# EAGLE design 526_outin_picoRev102 (EAGLE 9.6.0)
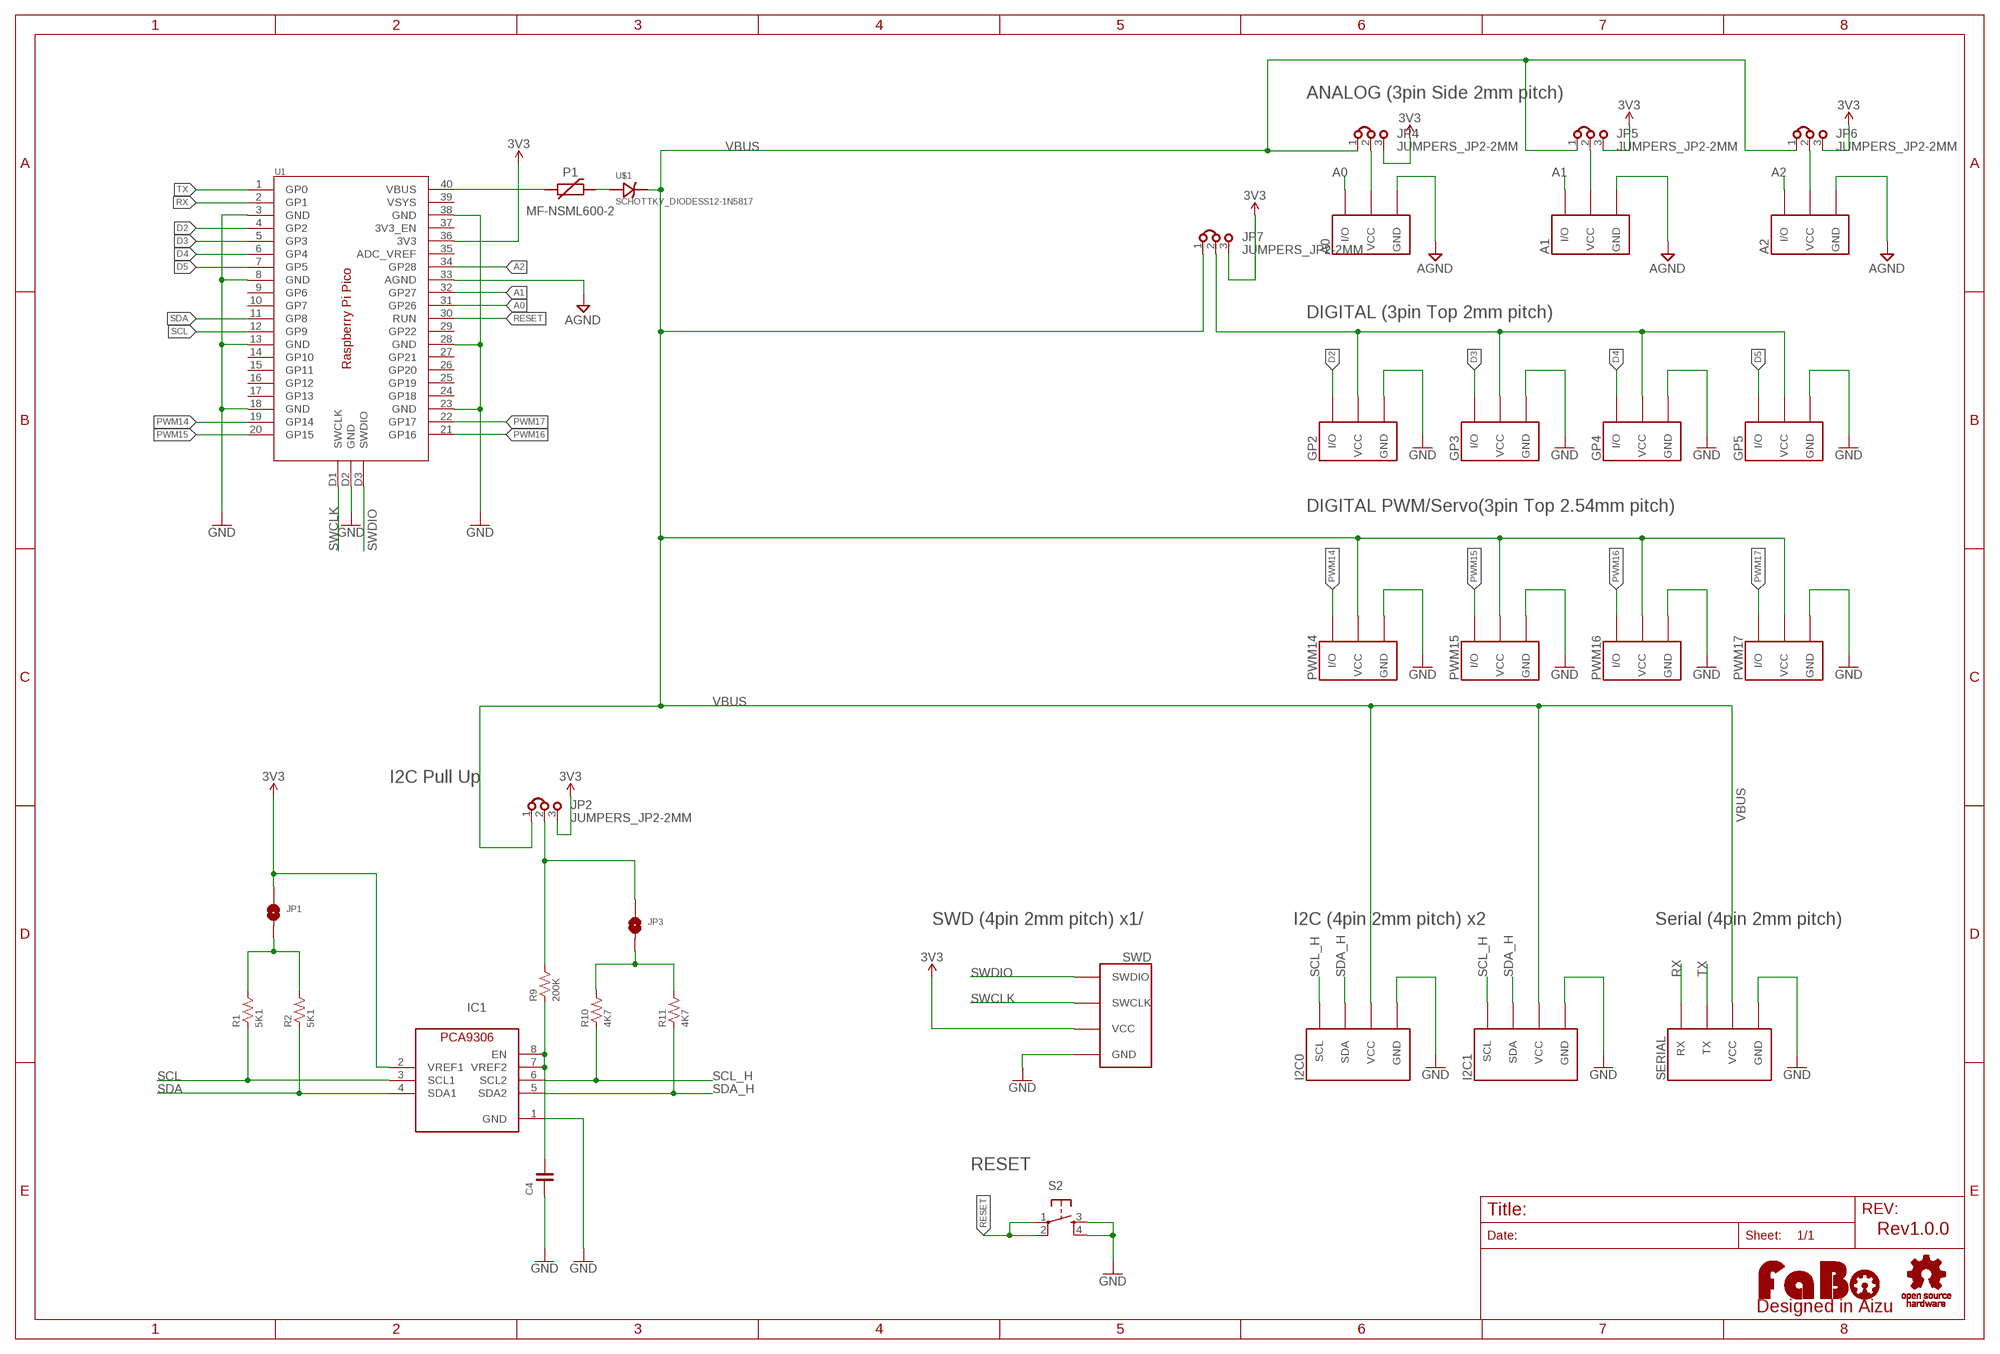
[diagram p0: schematic, sheet 1]

## Parts
A0  FABO_BRICK_3PIN-S03B-PASK-2_LONG  [FABO_BRICK_3PIN_S03B-PASK-2_LONG]
A1  FABO_BRICK_3PIN-S03B-PASK-2_LONG  [FABO_BRICK_3PIN_S03B-PASK-2_LONG]
A2  FABO_BRICK_3PIN-S03B-PASK-2_LONG  [FABO_BRICK_3PIN_S03B-PASK-2_LONG]
C4  CAPACITOR-0603_NARROW  [0603-NARROW]
GP2  FABO_BRICK_3PIN-S03B-PASK-2_LONG  [FABO_BRICK_3PIN_S03B-PASK-2_LONG]
GP3  FABO_BRICK_3PIN-S03B-PASK-2_LONG  [FABO_BRICK_3PIN_S03B-PASK-2_LONG]
GP4  FABO_BRICK_3PIN-S03B-PASK-2_LONG  [FABO_BRICK_3PIN_S03B-PASK-2_LONG]
GP5  FABO_BRICK_3PIN-S03B-PASK-2_LONG  [FABO_BRICK_3PIN_S03B-PASK-2_LONG]
I2C0  FABO_BRICK_I2C-S04B-PASK-2_LONG  [FABO_BRICK_I2C_S04B-PASK-2_LONG]
I2C1  FABO_BRICK_I2C-S04B-PASK-2_LONG  [FABO_BRICK_I2C_S04B-PASK-2_LONG]
IC1  PCA9306_SSOP  [8PIN-SSOP]
JP1  SMD-JUMPER-2_SHORT  [SMD-JUMPER-2-SHORT]
JP2  JUMPERS_JP2-2MM  [JUMPERS_JP2-2MM]
JP3  SMD-JUMPER-2_SHORT  [SMD-JUMPER-2-SHORT]
JP4  JUMPERS_JP2-2MM  [JUMPERS_JP2-2MM]
JP5  JUMPERS_JP2-2MM  [JUMPERS_JP2-2MM]
JP6  JUMPERS_JP2-2MM  [JUMPERS_JP2-2MM]
JP7  JUMPERS_JP2-2MM  [JUMPERS_JP2-2MM]
LOGO1  LOGO_OSHW-M_BOTTOM  [LOGO_OSHW_M_BOTTOM]
LOGO2  LOGO_FABO-M  [LOGO_FABO_M]
P1  MF-NSML600-2  POLYSWITCH1206  [1206]
PWM14  FABO_BRICK_3PIN-HEADER  [FABO_BRICK_3PIN_HEADER]
PWM15  FABO_BRICK_3PIN-HEADER  [FABO_BRICK_3PIN_HEADER]
PWM16  FABO_BRICK_3PIN-HEADER  [FABO_BRICK_3PIN_HEADER]
PWM17  FABO_BRICK_3PIN-HEADER  [FABO_BRICK_3PIN_HEADER]
R1  5K1  RESISTOR-0603  [0603]
R2  5K1  RESISTOR-0603  [0603]
R9  200K  RESISTOR-0603  [0603]
R10  4K7  RESISTOR-0603  [0603]
R11  4K7  RESISTOR-0603  [0603]
S2  TACT-SWITCH-SMD_KMR2  [KMR2]
SERIAL  FABO_BRICK_SERIAL-S04B-PASK-2_LONG  [FABO_BRICK_SERIAL_S04B-PASK-2_LONG]
SWD  FABO-SWD-4PIN  [FABO_BRICK_SWD_B04B-PASK-1_SILK]
U1  RASPBERRY_PI_PICO  [RASPBERRY_PI_PICO_SMD]
U$1  SCHOTTKY_DIODESS12-1N5817  [DO-214AC]

## Nets
3V3: IC1.2(VREF1) JP1.1 JP2.3 JP4.3 JP5.3 JP6.3 JP7.3 SWD.VCC U1.36(3V3)
A0: A0.I/O U1.31(GP26)
A1: A1.I/O U1.32(GP27)
A2: A2.I/O U1.34(GP28)
AGND: A0.GND A1.GND A2.GND U1.33(AGND)
D2: GP2.I/O U1.4(GP2)
D3: GP3.I/O U1.5(GP3)
D4: GP4.I/O U1.6(GP4)
D5: GP5.I/O U1.7(GP5)
GND: C4.1 GP2.GND GP3.GND GP4.GND GP5.GND I2C0.GND I2C1.GND IC1.1(GND) PWM14.GND PWM15.GND PWM16.GND PWM17.GND S2.3 S2.4 SERIAL.GND SWD.GND U1.3(GND) U1.8(GND) U1.13(GND) U1.18(GND) U1.23(GND) U1.28(GND) U1.38(GND) U1.D2(GND)
N$1: A2.VCC JP6.2
N$2: A1.VCC JP5.2
N$3: JP1.2 R1.2 R2.2
N$4: A0.VCC JP4.2
N$5: GP2.VCC GP3.VCC GP4.VCC GP5.VCC JP7.2
N$8: P1.P$2 U$1.CATHODE(ANODE)
N$10: JP2.2 JP3.1 R9.2
N$11: JP3.2 R10.2 R11.2
N$12: C4.2 IC1.7(VREF2) IC1.8(EN) R9.1
PWM14: PWM14.I/O U1.19(GP14)
PWM15: PWM15.I/O U1.20(GP15)
PWM16: PWM16.I/O U1.21(GP16)
PWM17: PWM17.I/O U1.22(GP17)
RESET: S2.1 S2.2 U1.30(RUN)
RX: SERIAL.RX U1.2(GP1)
SCL: IC1.3(SCL1) R1.1 U1.12(GP9)
SCL_H: I2C0.SCL I2C1.SCL IC1.6(SCL2) R10.1
SDA: IC1.4(SDA1) R2.1 U1.11(GP8)
SDA_H: I2C0.SDA I2C1.SDA IC1.5(SDA2) R11.1
SWCLK: SWD.SWCLK U1.D1(SWCLK)
SWDIO: SWD.SWDIO U1.D3(SWDIO)
TX: SERIAL.TX U1.1(GP0)
VBUS: I2C0.VCC I2C1.VCC JP2.1 JP4.1 JP5.1 JP6.1 JP7.1 PWM14.VCC PWM15.VCC PWM16.VCC PWM17.VCC SERIAL.VCC U$1.ANODE(CATHODE)
VS: P1.P$1 U1.40(VBUS)
Unconnected: U1.9(GP6) U1.10(GP7) U1.14(GP10) U1.15(GP11) U1.16(GP12) U1.17(GP13) U1.24(GP18) U1.25(GP19) U1.26(GP20) U1.27(GP21) U1.29(GP22) U1.35(ADC_VREF) U1.37(3V3_EN) U1.39(VSYS)

## Notes on the sheet
- ANALOG (3pin Side 2mm pitch)
- DIGITAL (3pin Top 2mm pitch)
- DIGITAL PWM/Servo(3pin Top 2.54mm pitch)
- I2C Pull Up
- SWD (4pin 2mm pitch) x1/ | I2C (4pin 2mm pitch) x2 | Serial (4pin 2mm pitch)
- RESET
- Rev1.0.0

## Library data of the parts
A0 A1 A2 GP2-GP5 PWM14-PWM17 = FaBo-Template:FABO_BRICK_3PIN: FaBo Brick 3pin
C4 = FaBo-Capacitor:CAPACITOR: CAPACITOR
I2C0 I2C1 = FaBo-Template:FABO_BRICK_I2C: FaBo Brick I2C
IC1 = FaBo-LevelTranslator:PCA9306
JP1 JP3 = FaBo-PIN:SMD-JUMPER-2
JP2 JP4-JP7 = 52101-101-REV-A_v16:JUMPERS_JP2-: Jumper/Bridge
LOGO1 = FaBo-Logo:LOGO_OSHW
LOGO2 = FaBo-Logo:LOGO_FABO
P1 = FaBo-Supply:POLYSWITCH
R1 R2 R9-R11 = FaBo-Resistors:RESISTOR: RESISTOR
S2 = FaBo-Switch:TACT-SWITCH: Part No Maker Datasheet Distributor 1273HA-160G-G SWITRONIC Catalog <http://www.switronic.com/uploads/images/A10.gif> Akizuki <http://akizukidenshi.com/catalog/g/gP-02561/> DTS-6-V Cosland DTS 6 Series <http://www.cosland.com/newproduct/DTS%20SERIES.pdf> Akizuki <http://akizukidenshi.com/catalog/g/gP-03647/> KMR2 C&K KMR2 SERIES <https://www.ckswitches.com/products/switches/product-details/Tactile/KMR2/> Octoparts Result <https://octopart.com/search?q=KMR2&start=0> TSHA-T-XB2-19E TOP UP INDUSTORY TSHA-T <http://www.top-up.com.tw/front/bin/ptdetail.phtml?Part=TSHA-T> Akizuki <http://akizukidenshi.com/catalog/g/gP-09361/>
SERIAL = FaBo-Template:FABO_BRICK_SERIAL: FaBo Brick Serial
SWD = FaBo-Connetor:FABO-SWD-4PIN
U1 = FaBo-Boards:RASPBERRY_PI_PICO
U$1 = FaBo-Diode:SCHOTTKY_DIODE

## Board
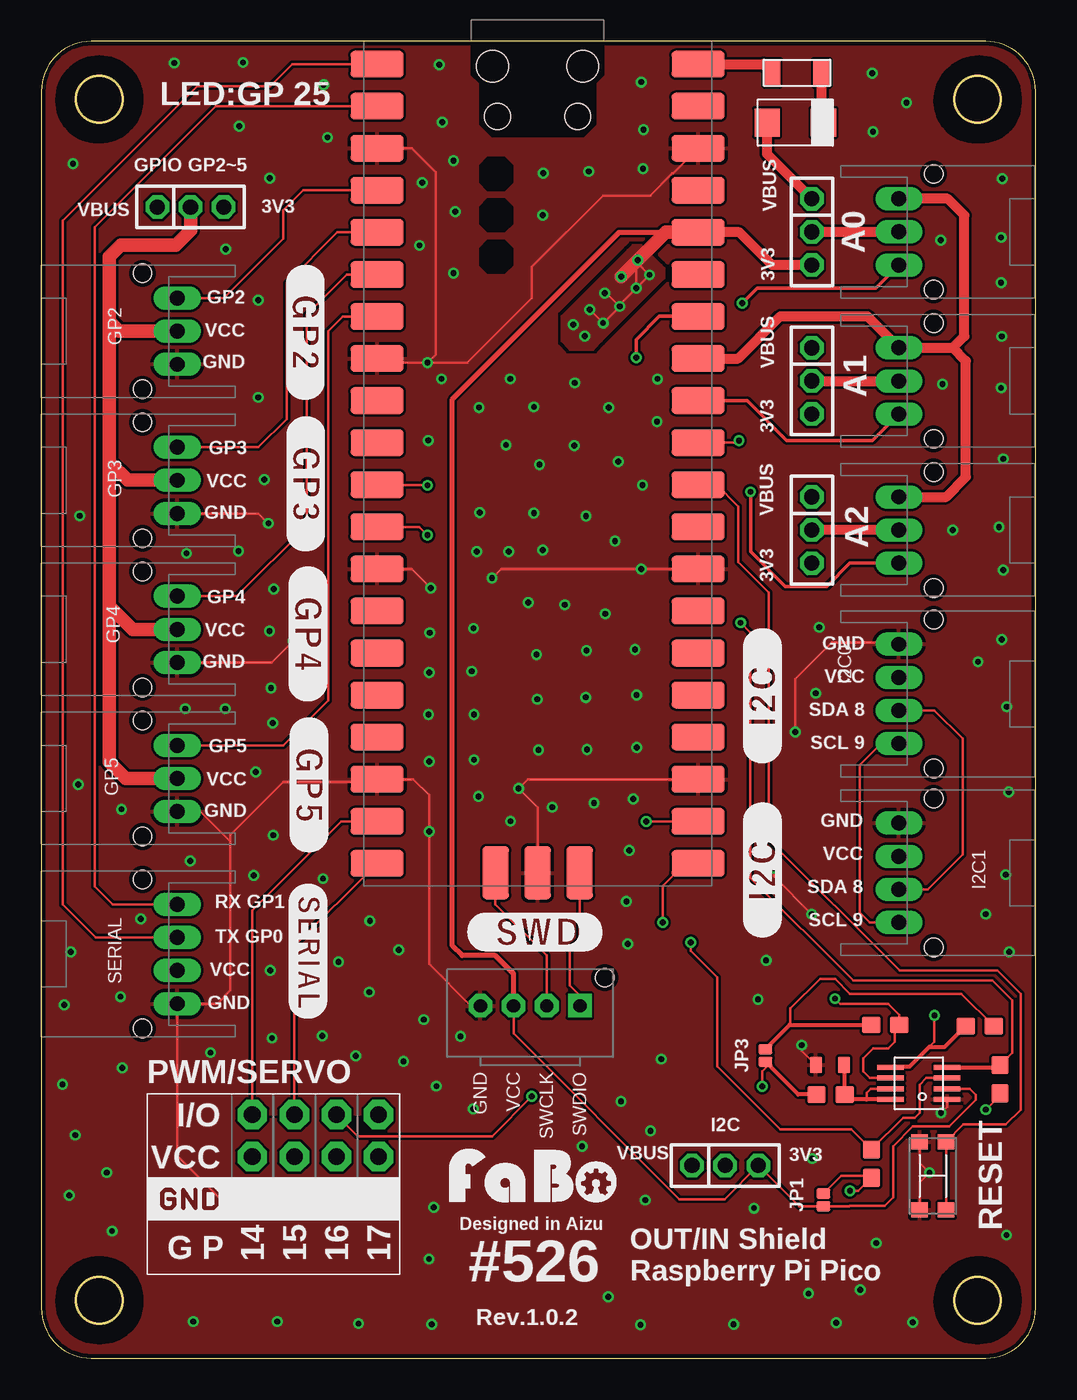
[diagram p1: board, top side]
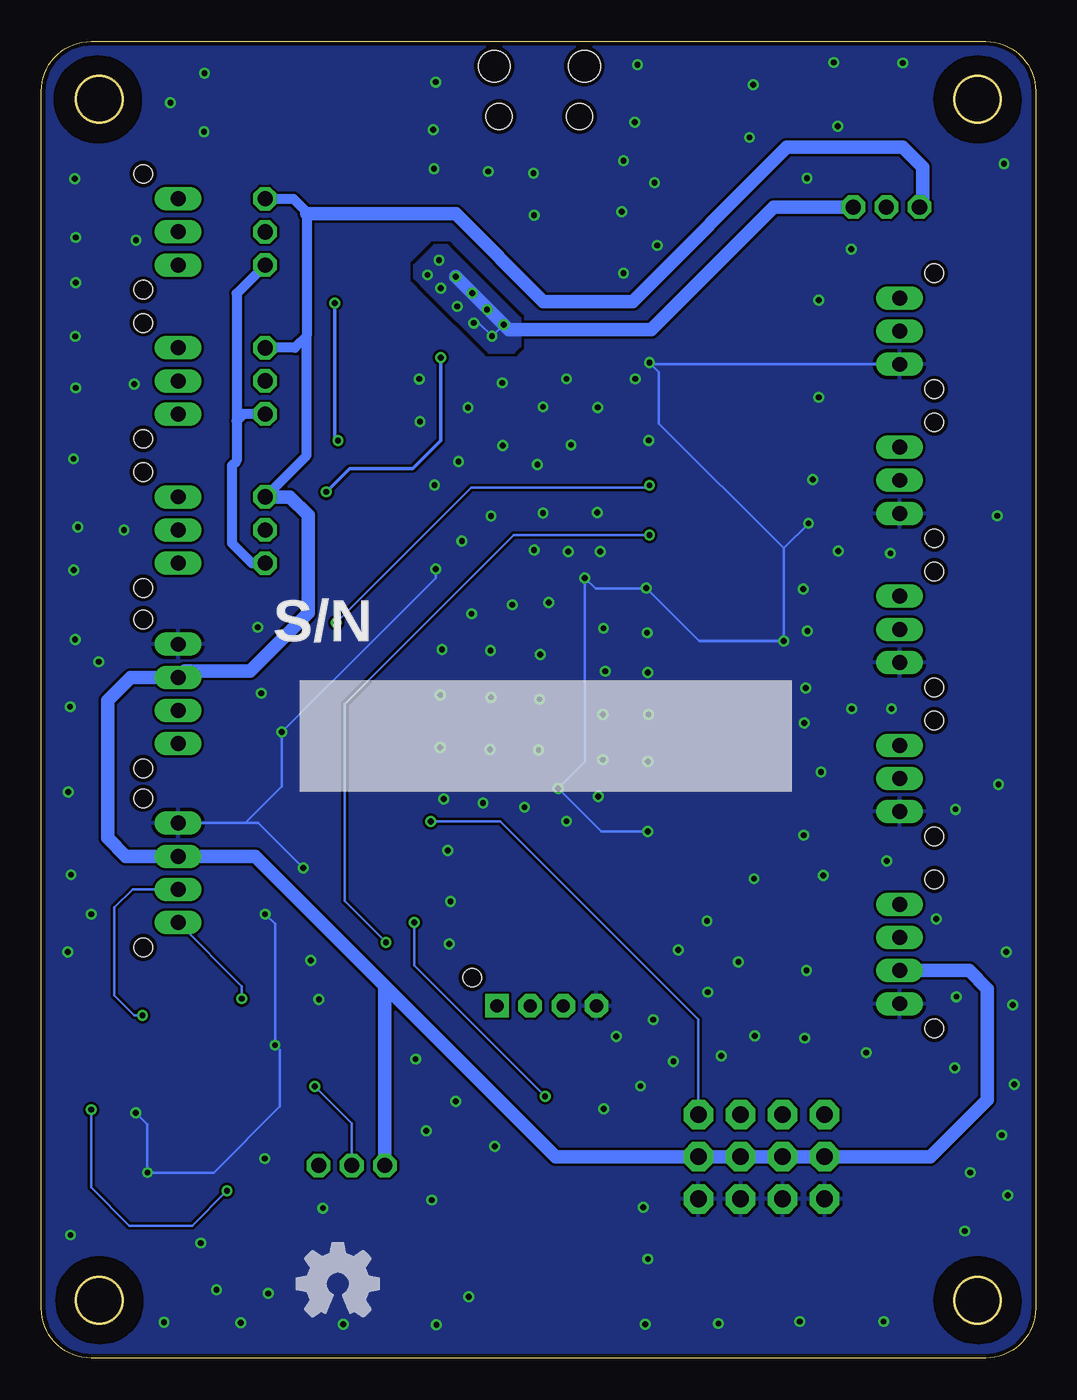
[diagram p2: board, bottom side, seen from below]

Size 60 x 79.5 mm. Coordinates in mm from the lower left corner, seen from the top.
Outline: 57,79.5 3,79.5 arc90 0,76.5 0,3 arc90 3,0 57,0 arc90 60,3 60,76.5 arc90 57,79.5
Outline: circle at 3.5,76 radius 1.4
Outline: circle at 56.5,76 radius 1.4
Outline: circle at 3.5,3.5 radius 1.4
Outline: circle at 56.5,3.5 radius 1.4
Copper layers (1*16): Top 0.035mm / dielectric 1.6mm / Bottom 0.035mm
Design rules "PCBway": minimum track width 6mil, minimum drill 12mil, track to track 6mil, track to pad 6mil, pad to pad 6mil, via to via 6mil, smd to smd 6mil, copper to edge 10mil, drill to drill 10mil, minimum pad ring 10mil, minimum via ring 6mil, stop-mask expansion 2mil, vias tented up to drill 100mil, thermal gap 8mil
tRestrict: area 53.9,0.9 to 59.1,6.1; area 53.9,73.4 to 59.1,78.6; area 0.9,73.4 to 6.1,78.6; area 0.9,0.9 to 6.1,6.1; 2 lines
bRestrict: area 53.9,0.9 to 59.1,6.1; area 0.9,73.4 to 6.1,78.6; area 54,73.4 to 59.2,78.6; area 0.9,0.9 to 6.1,6.1

### Footprints (pad centres in the part's own frame; a part is rotated, then mirrored left to right if it is on the bottom)
FABO_BRICK_3PIN_S03B-PASK-2_LONG = drill 0.9 pad 1.422 long: GND -2,0; I/O 2,0; VCC 0,0 | hole 1.1: 3.5,2.1; -3.5,2.1
0603-NARROW = smd 0.71 x 1: 1 -0.85,0; 2 0.85,0
FABO_BRICK_I2C_S04B-PASK-2_LONG = drill 0.9 pad 1.422 long: GND -3,0; SCL 3,0; SDA 1,0; VCC -1,0 | hole 1.1: 4.5,2.1; -4.5,2.1
8PIN-SSOP = smd 0.3 x 1.6: 1 -0.975,-1.7; 2 -0.325,-1.7; 3 0.325,-1.7; 4 0.975,-1.7; 5 0.975,1.7; 6 0.325,1.7; 7 -0.325,1.7; 8 -0.975,1.7
SMD-JUMPER-2-SHORT = smd 0.61 x 0.838: 1 -0.381,0; 2 0.381,0
JUMPERS_JP2-2MM = drill 0.914 octagon: 1 -2,0; 2 0,0; 3 2,0
1206 = smd 1 x 1.6: P$1 -1.5,0; P$2 1.5,0
FABO_BRICK_3PIN_HEADER = drill 1 pad 1.778 octagon: GND -2.54,0; I/O 2.54,0; VCC 0,0
0603 = smd 1.1 x 1: 1 -0.85,0; 2 0.85,0
KMR2 = smd 0.9 x 1: 1 -2.05,0.8; 2 2.05,0.8; 3 2.05,-0.8; 4 -2.05,-0.8
FABO_BRICK_SERIAL_S04B-PASK-2_LONG = drill 0.9 pad 1.422 long: GND -3,0; RX 3,0; TX 1,0; VCC -1,0 | hole 1.1: 4.5,2.1; -4.5,2.1
FABO_BRICK_SWD_B04B-PASK-1_SILK = drill 0.8 pad 1.422 octagon: GND -3,0; SWCLK 1,0; VCC -1,0 | drill 0.8 pad 1.422 square: SWDIO 3,0 | hole 1.1: 4.5,1.7
RASPBERRY_PI_PICO_SMD = smd 3.2 x 1.6: 1 -9.69,24.13; 2 -9.69,21.59; 3 -9.69,19.05; 4 -9.69,16.51; 5 -9.69,13.97; 6 -9.69,11.43; 7 -9.69,8.89; 8 -9.69,6.35; 9 -9.69,3.81; 10 -9.69,1.27; 11 -9.69,-1.27; 12 -9.69,-3.81; 13 -9.69,-6.35; 14 -9.69,-8.89; 15 -9.69,-11.43; 16 -9.69,-13.97; 17 -9.69,-16.51; 18 -9.69,-19.05; 19 -9.69,-21.59; 20 -9.69,-24.13; 21 9.69,-24.13; 22 9.69,-21.59; 23 9.69,-19.05; 24 9.69,-16.51; 25 9.69,-13.97; 26 9.69,-11.43; 27 9.69,-8.89; 28 9.69,-6.35; 29 9.69,-3.81; 30 9.69,-1.27; 31 9.69,1.27; 32 9.69,3.81; 33 9.69,6.35; 34 9.69,8.89; 35 9.69,11.43; 36 9.69,13.97; 37 9.69,16.51; 38 9.69,19.05; 39 9.69,21.59; 40 9.69,24.13 | smd 1.6 x 3.2: D1 -2.54,-24.7; D2 0,-24.7; D3 2.54,-24.7 | hole 1.9: 2.725,24; -2.725,24 | hole 1.55: 2.425,20.97; -2.425,20.97
DO-214AC = smd 1.52 x 1.68: ANODE 1.7,0; CATHODE -1.7,0

### Placement (x,y rotation side)
A0  51.75,68 270 top
A1  51.75,59 270 top
A2  51.75,50 270 top
C4  47.6,17.7 0 top
GP2  8.2,62 90 top
GP3  8.2,53 90 top
GP4  8.2,44 90 top
GP5  8.2,35 90 top
I2C0  51.75,40.1 270 top
I2C1  51.75,29.3 270 top
IC1  52.96,16.59 90 top
JP1  47.2,9.55 90 top
JP2  41.27,11.63 0 top
JP3  43.7,18.27 90 top
JP4  46.5,68 270 top
JP5  46.5,59 270 top
JP6  46.5,50 270 top
JP7  9,69.5 0 top
LOGO1  42.1,4.49 0 top
LOGO2  29.66,9.03 0 top
P1  45.6,77.6 0 top
PWM14  12.72,12.15 90 top
PWM15  15.27,12.15 90 top
PWM16  17.8,12.15 90 top
PWM17  20.34,12.15 90 top
R1  50.1,11.74 270 top
R2  57.86,16.84 270 top
R9  47.63,15.91 180 top
R10  50.93,20.12 180 top
R11  56.63,20.05 0 top
S2  53.8,11 270 top
SERIAL  8.2,24.4 90 top
SWD  29.5,21.27 0 top
U1  29.95,54 0 top
U$1  45.5,74.6 180 top
U$19  [LOGO_SILK_GND]  7.01,8.35 0 top

### Tracks (layer width: path | path; a pad name or v marks a point on that pad's centre or on a via)
3V3  (via drill 0.35)
  Top 0.152: IC1.2 56.03,16.27 56.4,15.9 56.4,15.6 54.8,14 52.6,14 51.4,12.8 51.4,9.7 50.9,9.2 48.8,9.2 48.77,9.17 JP1.1 45.73,9.17 JP2.3 41.24,9.6 38.5,9.6 28.5,19.6 SWD.VCC | v33.1,63.3 v33.9,62.5 v34.9,63.5 | v34.9,63.5 34.9,63.6 v35.9,64.6 35.9,64.7 | v34.9,63.5 34.1,64.3 v34,64.3 | 35.9,64.7 35.9,66.2 36.1,66.4 | v36,66.3 36,66.1 v36.7,65.4 36,64.7 35.9,64.7
  Top 0.305: SWD.VCC 28.5,23.2 27.4,24.3 25.4,24.3 24.8,24.9 24.8,57.9 34.88,67.97 37.67,67.97
  Top 0.61: JP4.3 44.1,66 42.12,67.97 | 42.12,67.97 | 42.12,67.97 U1.36
  Top 0.813: v35,65.3 36.1,66.4 37.67,67.97 37.68,67.97 U1.36
  Bottom 0.152: 43.27,11.47 JP2.3 | v32.1,62.4 v32.8,61.7 33.6,62.5 v33.9,62.5
  Bottom 0.61: JP5.3 47.8,57 48.22,56.59 | 48.22,56.59 48.22,54.17 48.5,53.89 48.5,49.2 47.3,48 JP6.3 | JP4.3 48.22,64.28 48.22,56.59
  Bottom 0.813: JP7.3 15.8,69.5 23.2,62.1 31.8,62.1 v32.1,62.4 v35,65.3
  pour Top (no thermals): 31.4,61.4 31.4,62.9 35.4,66.9 35.7,67.2 36.2,67.2 37.4,66 37.6,65.8 37.6,65.4 37.6,65.2 33.8,61.4 33.3,60.9 32,60.9 31.9,60.9
  pour Bottom (no thermals): 31.1,61.1 31.1,62.8 35.4,67.1 35.5,67.2 36.3,67.2 37.5,66 37.5,65.2 36.7,64.4 33,60.7 31.6,60.7 31.5,60.7
A0  (via drill 0.35)
  Top 0.152: 41.97,55.27 U1.31
  Top 0.2: A0.I/O 50.35,64.6 43.2,64.6 v42.3,63.7 | v42.1,55.4 41.97,55.27
  Bottom 0.152: 51.75,65.62 A0.I/O 51.75,65.5
  Bottom 0.2: v42.3,63.7 42.3,55.6 v42.1,55.4
A1
  Top 0.2: A1.I/O 50.15,55.4 45,55.4 42.59,57.81 U1.32
A2  (via drill 0.35)
  Top 0.152: 39.5,62.75 U1.34
  Top 0.2: A2.I/O 48.8,48 47.4,46.6 44.9,46.6 42.8,48.7 v42.8,52.3 | v35.9,60.4 35.9,61.5 37.3,62.9 U1.34
  Bottom 0.2: v42.8,52.3 41.4,53.7 37.6,53.7 35.9,55.4 v35.9,60.4
AGND
  Top 0.61: U1.33 42.05,60.35 44.6,62.9 49.85,62.9 A1.GND 55,61 | 55,61 55.7,61.7 55.7,69 54.7,70 A0.GND | A2.GND 54.6,52 55.8,53.2 55.8,60.2 55,61
D2
  Top 0.152: GP2.I/O 11,64 14.6,67.6 14.6,69.3 15.81,70.51 U1.4
D3
  Top 0.152: GP3.I/O 13.1,55 14.8,56.7 14.8,64.9 17.87,67.97 U1.5
D4
  Top 0.152: GP4.I/O 11.8,46 16,50.2 16,63 18.43,65.43 U1.6
D5
  Top 0.152: GP5.I/O 14.6,37 17.3,39.7 17.3,62 18.19,62.89 U1.7
GND  (via drill 0.35)
  Top 0.152: 40.34,73.75 U1.38 38.13,71.54 38.09,71.54 36.75,70.2 33.9,70.2 29.6,65.9 29.6,63.99 25.71,60.1 v23.3,60.1 | IC1.1 54.66,15.16 v54.3,14.8 | S2.4 53,11.8 v53.6,11.2 53,10.6 S2.3 | PWM17.GND PWM16.GND PWM15.GND PWM14.GND 10.79,9.62 8.2,12.2 SERIAL.GND 10.6,21.4 11.4,22.2 11.4,31.2 | GP5.GND 9.6,33 11.4,31.2 | 11.4,31.2 11.4,31.6 14.6,34.8 20.11,34.8 U1.18 22.45,34.95 23.4,34 v23.4,31.8 23.4,23.8 25.93,21.27 SWD.GND | GP4.GND 13.9,42 v15.2,43.3 | v23.5,46.5 22.35,47.65 U1.13 | GP3.GND 13.1,51 v13.7,50.4 | U1.8 20.51,60.1 v23.3,60.1 | U1.3 22.35,73.05 23.8,71.6 23.8,60.6 v23.3,60.1 | U1.23 29.35,34.95 v28.8,34.4 29.95,33.25 U1.D2 | v45.5,37.8 45.5,41 47.7,43.2 51.65,43.2 I2C0.GND | v27.2,47.1 27.75,47.65 v36.2,47.65 U1.28 | C4.1 45.9,18.55 v45.9,18.9 | v46.5,26.8 44.2,29.1 v44.2,29.6
  Bottom 0.152: SERIAL.GND 7.97,21.4 | v54.3,14.8 53.6,14.1 v53.6,11.2 49.6,11.2 45.6,15.2 45.6,18.6 v45.9,18.9 45.9,26.2 v46.5,26.8 | 23.45,46.45 20.3,43.3 v15.2,43.3 15.2,48.9 | 23.45,46.45 v23.5,46.5 | v13.7,50.4 15.2,48.9 | 15.2,48.9 22.74,56.44 22.74,59.54 v23.3,60.1 23.2,60 GP2.GND | v23.4,31.8 26.2,31.8 v28.8,34.4 27.2,36 v27.2,47.1 26.55,46.45 23.45,46.45 | I2C1.GND 47.7,32.3 | 47.7,32.3 45.5,34.5 v45.5,37.8 36.2,47.1 v36.2,47.65 | v44.2,29.6 46.9,32.3 47.7,32.3
  other vias: 23.44,43.79 23.4,41.39 23.36,38.85 23.4,36.02 13.86,40.46 13.95,38.35 13.77,43.9 14.03,46.43 23.34,55.41 26.41,57.4 28.31,59.12 29.73,57.43 32.19,58.88 34.25,57.4 28.04,55.14 32.16,55.1 37.19,59.12 37.15,56.55 34.82,54.12 36.28,52.71 30.06,53.95 26.45,51.05 29.73,51.02 32.86,50.85 34.62,49.33 30.26,48.79 26.28,48.69 28.2,48.69 29.39,45.62 31.58,45.48 26.08,44.06 25.98,41.47 26.11,38.87 26.11,36.13 26.38,33.9 28.31,32.42 30.84,33.26 33.35,33.52 35.72,33.77 30,36.72 32.93,36.75 35.93,36.86 29.93,39.78 32.86,39.9 35.92,40.04 29.89,42.48 32.9,42.73 35.83,42.79 34.04,44.94 46.73,40.14 46.94,44.13 55.01,50 57.8,50.17 58.05,47.58 57.97,43.39 56.53,42.04 19.83,26.39 21.57,24.65 19.79,22.1 18.98,18.25 23.07,20.43 25.3,19.42 21.85,17.92 23.84,16.42 26.07,15.05 4.87,17.52 2.04,13.47 3.94,11.2 1.67,9.82 4.26,7.67 9.17,2.2 14.23,2.2 19.14,2.09 23.56,2.04 23.68,9.1 23.39,5.98 34.21,3.71 37.42,18.05 34.98,15.5 36.77,13.71 36.44,9.54 32.63,12.78 36.16,2 41.78,2.04 47.97,2.14 52.6,2.16 49.43,4.12 46.3,3.9 43.01,9.05 50.38,6.95 58.25,7.43 43.74,24 43.25,21.65 35.39,25.02 35.31,27.57 35.47,30.65 30.3,71.54 30.26,69.01 33.03,71.65 36.34,74.18 36.21,77.05 36.31,71.81 17.27,73.7 17.03,76.88 8.02,78.2 12.17,78.23 5.99,26.51 2.31,50.85 2.23,34.64 11.93,74.38 13.79,71.24 1.9,72.12 11.12,66.96 13.08,63.88 13.08,58.01 13.45,53.05 11.9,48.73 8.76,48.59 11.09,39.21 8.69,39.21 12.94,35.39 13.99,31.57 12.81,29.15 17,28.94 13.82,23.41 13.92,19.32 10.21,18.44 24.02,78.09 24.19,74.62 50.15,77.58 50.19,74.04 52.21,75.8 57.99,71.2 57.92,64.93 57.92,58.58 58.06,54.29 57.96,61.69 57.92,67.66 58.27,39.32 58.39,34.19 58.21,29.19 58.41,24.52 16.95,19.45 17.93,23.92 24.15,59.12 24.87,65.51 24.97,69.23 24.87,72.3 22.82,67.18 22.99,70.97 54.29,67.5 54.39,58.8 56.99,26.8 46.52,12.05 4.83,33.14 4.77,21.82 1.37,21.32 1.27,16.52 1.77,24.52 8.97,30.02
  pour Bottom (rank 6): -4.8,84.1 64.1,84.1 64.1,-8.1 -4.8,-8.1
  pour Top (rank 6): -5.3,85.6 64.8,85.6 64.8,-9.2 -5.3,-9.2
N$1
  Top 0.61: A2.VCC JP6.2
N$2
  Top 0.61: JP5.2 A1.VCC
N$3  (via drill 0.35)
  Top 0.152: JP1.2 48.26,11 49.99,11 R1.2 49.31,10.1 v48.8,10.1 | R2.2 57.86,15.86 v57,15
  Bottom 0.152: v57,15 57,10.3 54.7,8 50.9,8 v48.8,10.1
N$4
  Top 0.61: JP4.2 A0.VCC
N$5
  Top 0.813: JP7.2 9,68.1 8.1,67.2 4.8,67.2 4.1,66.5 4.1,62.6 | GP3.VCC 5.2,53 4.1,54.1 | 4.1,54.1 4.1,62.6 | 4.1,45.4 4.1,54.1 | 4.1,45.4 5.5,44 GP4.VCC | GP5.VCC 5.1,35 4.1,36 4.1,45.4 | GP2.VCC 4.7,62 4.1,62.6
  Bottom 0.152: 8.45,53 GP3.VCC
N$8
  Top 0.61: U$1.CATHODE 47.1,74.7 P1.P$2
N$10  (via drill 0.35)
  Top 0.152: v43.5,16.4 43.5,17.3 43.89,17.69
  Top 0.254: R9.2 45.67,15.91 43.89,17.69 JP3.1
  Bottom 0.152: JP2.2 41.27,14.17 v43.5,16.4
N$11
  Top 0.152: R11.2 55.52,22 48.8,22 47.9,22.9 47,22.9 45.2,21.1 45.2,20.12
  Top 0.254: JP3.2 45.16,20.12 45.2,20.12 R10.2
N$12
  Top 0.152: IC1.8 | IC1.7 50.06,16.27 49.8,16 49.8,15.62
  Top 0.254: IC1.8 49.8,15.62 48.77,15.62 R9.1 48.48,17.67 C4.2
PWM14
  Top 0.152: PWM14.I/O 12.72,27.02 18.11,32.41 U1.19
PWM15
  Top 0.152: PWM15.I/O 15.27,24.88 U1.20
PWM16  (via drill 0.35)
  Top 0.152: PWM16.I/O 19.1,13.4 27.2,13.4 v29.6,15.8 | v37.5,26.3 37.5,28.5 39.2,30.2 39.31,30.2 U1.21
  Top 0.203: 39.28,29.52 U1.21
  Bottom 0.152: v29.6,15.8 37.5,23.7 v37.5,26.3
PWM17  (via drill 0.35)
  Top 0.152: v36.5,32.4 v36.51,32.41 40.1,32.41
  Top 0.203: U1.22 40.1,32.41 40.2,32.41
  Bottom 0.152: PWM17.I/O 20.34,20.45 32.3,32.4 v36.5,32.4
RESET
  Top 0.152: U1.30 40.77,52.73 42.07,51.43 42.07,48.06 43.9,46.23 43.9,31.3 51.8,23.4 57.7,23.4 59.1,22 59.1,15 58.2,14.1 55.65,14.1 S2.1 S2.2
RX
  Top 0.152: SERIAL.RX 4.3,27.4 3.23,28.47 3.23,68.29 10.53,75.59 U1.2
SCL  (via drill 0.35)
  Top 0.152: U1.12 22.81,50.19 v23.3,49.7 | v39.2,25.1 39.2,24.6 40.8,23 40.8,17.6 44.6,13.8 48.89,13.8 R1.1 52.01,14.5 52.7,14.5 53,14.8 53,16.5 53.41,16.91 IC1.3
  Bottom 0.152: v23.3,49.7 31.5,49.7 41.7,39.5 41.7,27.6 v39.2,25.1
SCL_H  (via drill 0.35)
  Top 0.152: R10.1 51.78,19.98 | R10.1 51.5,19.84 51.5,19.1 51.1,18.7 50.2,18.7 49.6,18.1 49.6,17.3 49.98,16.91 IC1.6 | v47.9,21.7 48.2,21.4 51.1,21.4 51.78,20.72 R10.1 | I2C0.SCL 50.7,37.1 49.4,35.8 49.4,26.9 50,26.3 I2C1.SCL
  Bottom 0.152: I2C1.SCL 47.9,22.45 v47.9,21.7
SDA  (via drill 0.35)
  Top 0.152: 23.27,52.73 v23.3,52.7 20.29,52.7 U1.11 | R2.1 58.6,18.43 58.6,21.6 57.4,22.8 49,22.8 42.8,29 42.8,43.8 v42.2,44.4
  Top 0.254: IC1.4 57.73,17.57 R2.1
  Bottom 0.152: v23.3,52.7 23.45,52.55 34.05,52.55 v42.2,44.4
SDA_H  (via drill 0.35)
  Top 0.152: v53.9,20.7 53.9,19.1 53.6,18.8 | I2C0.SDA 53.9,39.1 55.6,37.4 55.6,30.4 53.5,28.3 I2C1.SDA
  Top 0.254: IC1.5 51.3,17.6 52.4,17.6 53.6,18.8 54.53,18.8 R11.1
  Bottom 0.152: I2C1.SDA 54.5,28.3 55.6,27.2 55.6,21.9 54.4,20.7 v53.9,20.7
SWCLK
  Top 0.152: 27.23,29.11 U1.D1 | U1.D1 | SWD.SWCLK 30.5,24.3 27.41,27.39 U1.D1
SWDIO
  Top 0.152: 32.47,29.28 U1.D3 32.49,25.29 31.9,24.7 31.9,22.5 32.5,21.9 SWD.SWDIO
TX
  Top 0.152: U1.1 15.13,78.13 13.8,76.8 9.4,76.8 1.27,68.67 1.27,27.4 3.28,25.4 SERIAL.TX
VBUS
  Top 0.61: JP4.1 43.8,72.7 U$1.ANODE
  Bottom 0.61: JP4.1 44.8,70 44,69.2 44,69.1 44,61.7 | 44,61.7 44.7,61 JP5.1 | JP6.1 44,54.5 44,61.7
  Bottom 0.813: JP6.1 45,52 43.9,50.9 43.9,45 47.4,41.5 51.35,41.5 I2C0.VCC 54.6,41.1 56,39.7 56,31.4 54.9,30.3 I2C1.VCC 47.1,30.3 39.27,22.47 | 39.27,22.47 JP2.1 | 39.27,22.47 28.95,12.15 PWM17.VCC PWM16.VCC PWM15.VCC PWM14.VCC 6.34,12.15 2.9,15.6 2.9,22.3 4,23.4 SERIAL.VCC | 44,69.1 35,69.1 29.7,63.8 24.3,63.8 15,73.1 8,73.1 6.8,71.9 6.8,69.7 JP7.1
VS
  Top 0.61: U1.40 43.57,78.13 P1.P$1

### Text on the board
tPlace: LED:GP 25 | GPIO GP2~5 | VBUS | 3V3 | VBUS | 3V3 | GP2 | VCC | GND | VBUS | 3V3 | GP3 | VCC | GND | VBUS | 3V3 | GP4 | VCC | GND | GND | VCC | SDA 8 | GP5 | SCL 9 | VCC | GND | GND | VCC | RX GP1 | SDA 8 | SCL 9 | TX GP0 | VCC | GND | PWM/SERVO | I/O | I2C | VBUS | 3V3 | VCC | RESET | 14 | 15 | 16 | 17 | Designed in Aizu | G P | #526 | OUT/IN Shield / Raspberry Pi Pico | Rev.1.0.2
bPlace: S/N
Document: Raspberry Pi Pico Rev.1.0.2